# EAGLE design Kite-ARM-STM32F103 (EAGLE 6.5.0)
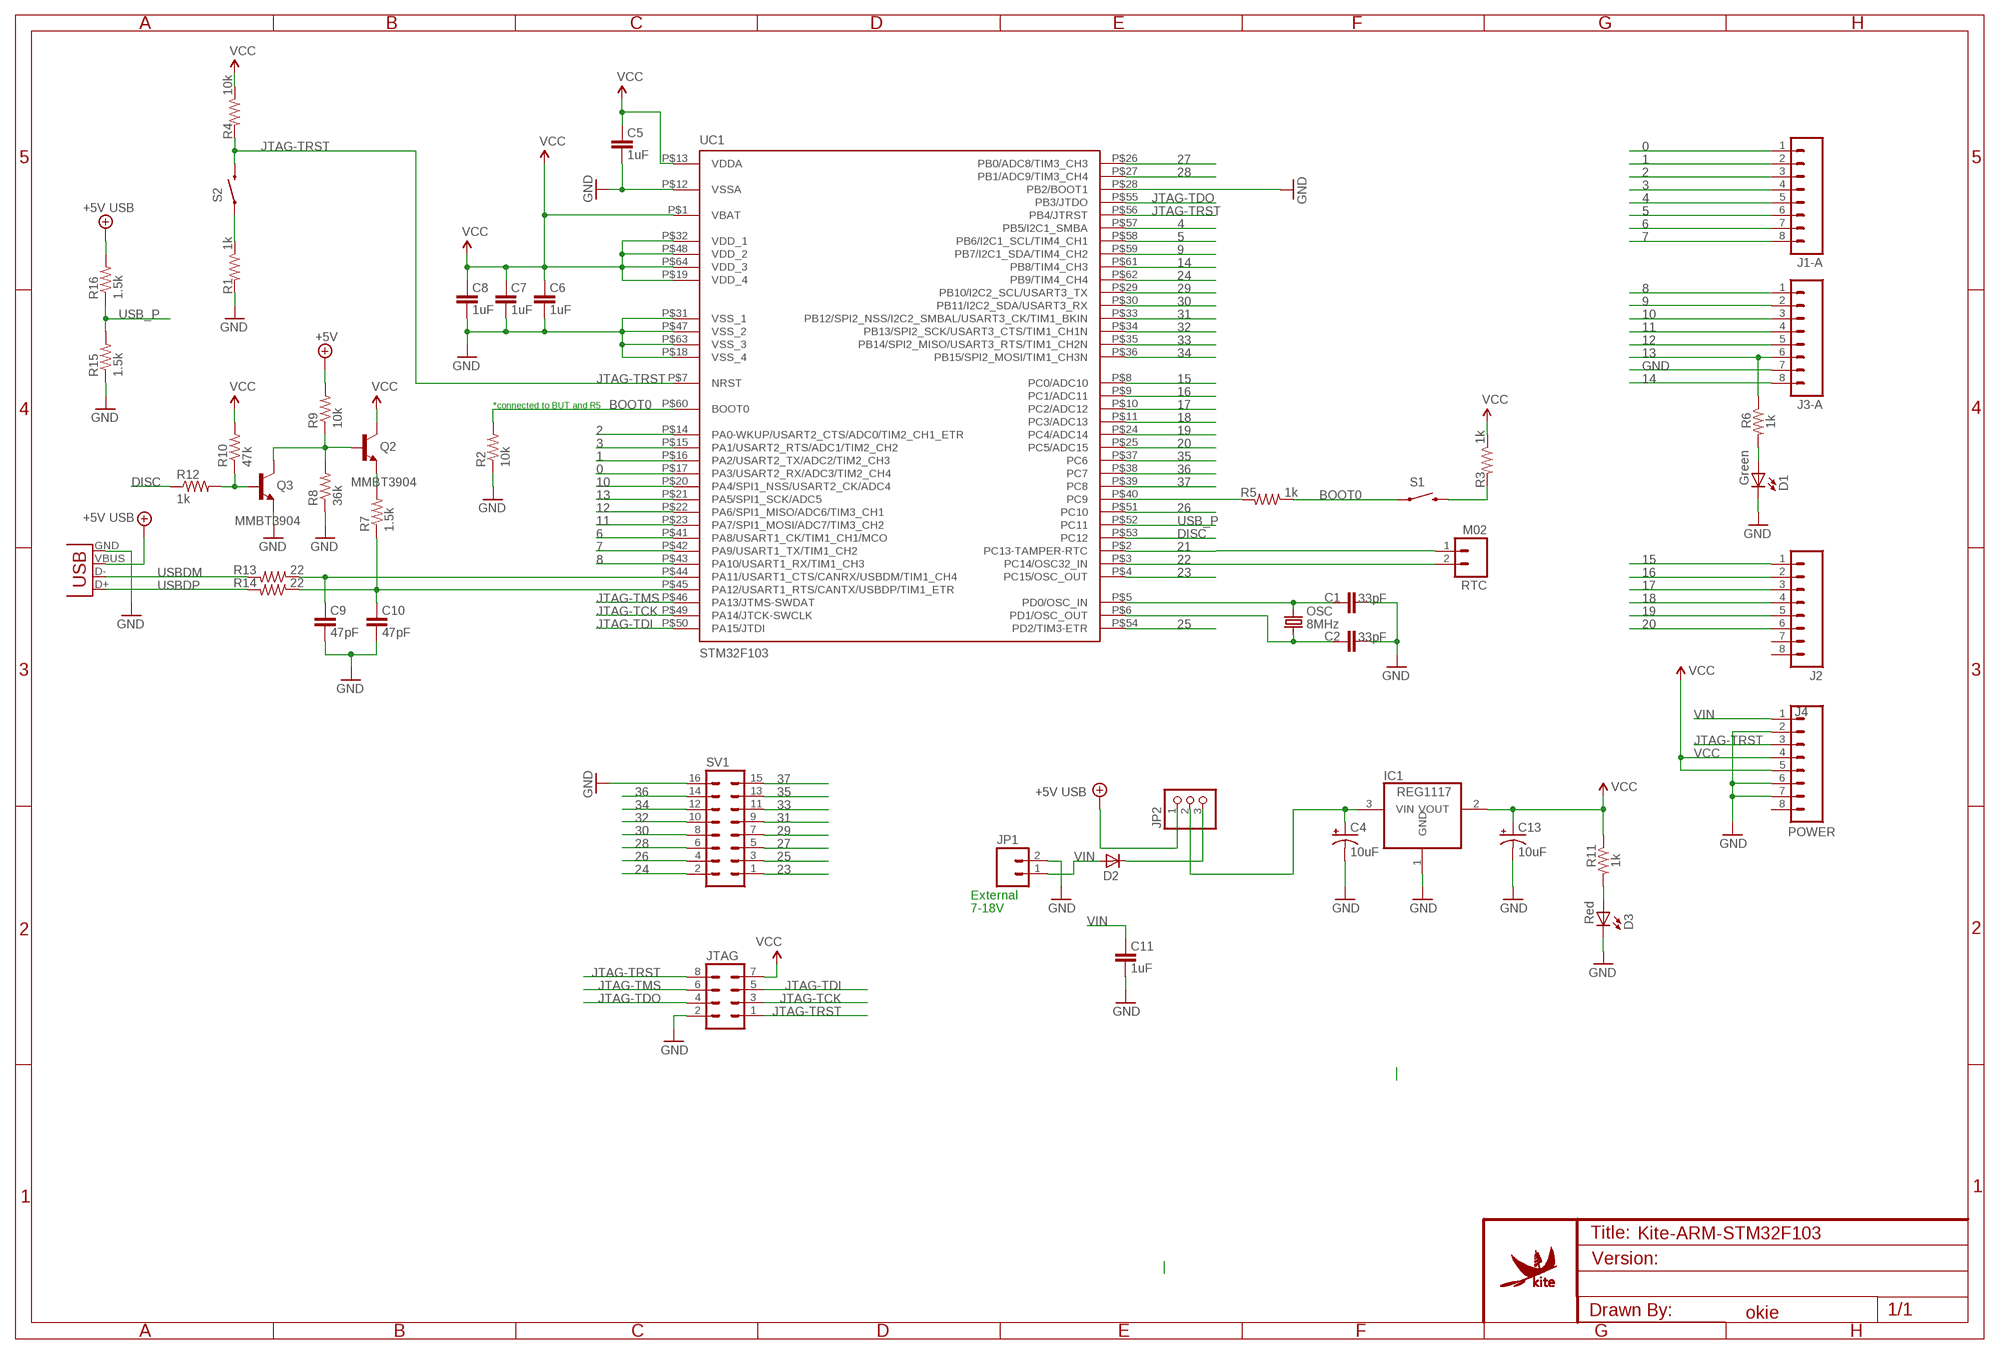
[diagram p0: schematic, sheet 1]

## Parts
C1  33pF  CAP0603  [0603]
C2  33pF  CAP0603  [0603]
C4  10uF  10UF-TANT  [EIA3216]
C5  1uF  CAP0603  [0603]
C6  1uF  CAP0603  [0603]
C7  1uF  CAP0603  [0603]
C8  1uF  CAP0603  [0603]
C9  47pF  CAP0603  [0603]
C10  47pF  CAP0603  [0603]
C11  1uF  CAP0603  [0603]
C13  10uF  10UF-TANT  [EIA3216]
D1  Green  LED0603  [LED-0603]
D2  DIODESMA  [SMA-DIODE]
D3  Red  LED0603  [LED-0603]
IC1  REG1117  [SOT223]
J1-A  M081X08  [1X08]
J2  M081X08  [1X08]
J3-A  M081X08  [1X08]
J4  POWER  M081X08  [1X08]
JP1  M02POLAR  [MOLEX-1X2]
JP2  PINHD-1X3  [1X03]
JTAG  MA04-2  [MA04-2]
OSC  8MHz  CRYSTAL5X3  [CRYSTAL-SMD-5X3]
Q2  MMBT3904  TRANSISTOR_NPNSOT23  [SOT23]
Q3  MMBT3904  TRANSISTOR_NPNSOT23  [SOT23]
R1  1k  RESISTOR0603  [0603]
R2  10k  RESISTOR0603  [0603]
R3  1k  RESISTOR0603  [0603]
R4  10k  RESISTOR0603  [0603]
R5  1k  RESISTOR0603  [0603]
R6  1k  RESISTOR0603  [0603]
R7  1.5k  RESISTOR0603  [0603]
R8  36k  RESISTOR0603  [0603]
R9  10k  RESISTOR0603  [0603]
R10  47k  RESISTOR0603  [0603]
R11  1k  RESISTOR0603  [0603]
R12  1k  RESISTOR0603  [0603]
R13  22  RESISTOR0603  [0603]
R14  22  RESISTOR0603  [0603]
R15  1.5k  RESISTOR0603  [0603]
R16  1.5k  RESISTOR0603  [0603]
RTC  M02  M02NG  [1X02]
S1  SWITCH-MOMENTARY-2-SMD-1101NE  [TACTILE-SWITCH-1101NE]
S2  SWITCH-MOMENTARY-2-SMD-1101NE  [TACTILE-SWITCH-1101NE]
SV1  MA08-2  [MA08-2]
U$3  KITE-LOGO-STM32-MEDIUM  [KITE-STM32-LOGO-MEDIUM]
UC1  STM32F103  [TQFP-10X10-64]
X1  USBSMD  [USB-MINIB]

## Nets
0: J1-A.1 UC1.P$17(PA3/USART2_RX/ADC3/TIM2_CH4)
1: J1-A.2 UC1.P$16(PA2/USART2_TX/ADC2/TIM2_CH3)
2: J1-A.3 UC1.P$14(PA0-WKUP/USART2_CTS/ADC0/TIM2_CH1_ETR)
3: J1-A.4 UC1.P$15(PA1/USART2_RTS/ADC1/TIM2_CH2)
4: J1-A.5 UC1.P$57(PB5/I2C1_SMBA)
5: J1-A.6 UC1.P$58(PB6/I2C1_SCL/TIM4_CH1)
6: J1-A.7 UC1.P$41(PA8/USART1_CK/TIM1_CH1/MCO)
7: J1-A.8 UC1.P$42(PA9/USART1_TX/TIM1_CH2)
8: J3-A.1 UC1.P$43(PA10/USART1_RX/TIM1_CH3)
9: J3-A.2 UC1.P$59(PB7/I2C1_SDA/TIM4_CH2)
10: J3-A.3 UC1.P$20(PA4/SPI1_NSS/USART2_CK/ADC4)
11: J3-A.4 UC1.P$23(PA7/SPI1_MOSI/ADC7/TIM3_CH2)
12: J3-A.5 UC1.P$22(PA6/SPI1_MISO/ADC6/TIM3_CH1)
13: J3-A.6 R6.1 UC1.P$21(PA5/SPI1_SCK/ADC5)
14: J3-A.8 UC1.P$61(PB8/TIM4_CH3)
15: J2.1 UC1.P$8(PC0/ADC10)
16: J2.2 UC1.P$9(PC1/ADC11)
17: J2.3 UC1.P$10(PC2/ADC12)
18: J2.4 UC1.P$11(PC3/ADC13)
19: J2.5 UC1.P$24(PC4/ADC14)
20: J2.6 UC1.P$25(PC5/ADC15)
21: RTC.1 UC1.P$2(PC13-TAMPER-RTC)
22: RTC.2 UC1.P$3(PC14/OSC32_IN)
23: SV1.1 UC1.P$4(PC15/OSC_OUT)
24: SV1.2 UC1.P$62(PB9/TIM4_CH4)
25: SV1.3 UC1.P$54(PD2/TIM3-ETR)
26: SV1.4 UC1.P$51(PC10)
27: SV1.5 UC1.P$26(PB0/ADC8/TIM3_CH3)
28: SV1.6 UC1.P$27(PB1/ADC9/TIM3_CH4)
29: SV1.7 UC1.P$29(PB10/I2C2_SCL/USART3_TX)
30: SV1.8 UC1.P$30(PB11/I2C2_SDA/USART3_RX)
31: SV1.9 UC1.P$33(PB12/SPI2_NSS/I2C2_SMBAL/USART3_CK/TIM1_BKIN)
32: SV1.10 UC1.P$34(PB13/SPI2_SCK/USART3_CTS/TIM1_CH1N)
33: SV1.11 UC1.P$35(PB14/SPI2_MISO/USART3_RTS/TIM1_CH2N)
34: SV1.12 UC1.P$36(PB15/SPI2_MOSI/TIM1_CH3N)
35: SV1.13 UC1.P$37(PC6)
36: SV1.14 UC1.P$38(PC7)
37: SV1.15 UC1.P$39(PC8)
+5V: JP2.1 R9.2 R16.2 X1.VBUS ; supply symbol labelled +5V USB
BOOT0: R2.2 R5.1 S1.P$1 UC1.P$60(BOOT0)
DISC: R12.1 UC1.P$53(PC12)
GND: C1.1 C2.1 C4.C(-) C5.1 C6.1 C7.1 C8.1 C9.1 C10.1 C11.1 C13.C(-) D1.C D3.C IC1.1(GND) J3-A.7 J4.2 J4.6 J4.7 JP1.2 JTAG.2 Q3.2(E) R1.2 R2.1 R8.1 R15.1 SV1.16 UC1.P$12(VSSA) UC1.P$18(VSS_4) UC1.P$28(PB2/BOOT1) UC1.P$31(VSS_1) UC1.P$47(VSS_2) UC1.P$63(VSS_3) X1.GND
JTAG-TCK: JTAG.3 UC1.P$49(PA14/JTCK-SWCLK)
JTAG-TDI: JTAG.5 UC1.P$50(PA15/JTDI)
JTAG-TDO: JTAG.4 UC1.P$55(PB3/JTDO)
JTAG-TMS: JTAG.6 UC1.P$46(PA13/JTMS-SWDAT)
JTAG-TRST: J4.3 JTAG.1 JTAG.8 R4.2 S2.P$2 UC1.P$7(NRST) UC1.P$56(PB4/JTRST)
N$1: D2.C JP2.3
N$2: C2.2 OSC.1 UC1.P$6(PD1/OSC_OUT)
N$3: C4.A(+) IC1.3(VIN) JP2.2
N$4: D3.A R11.2
N$6: C1.2 OSC.3 UC1.P$5(PD0/OSC_IN)
N$7: D1.A R6.2
N$8: Q2.2(E) R7.2
N$9: Q2.1(B) Q3.3(C) R8.2 R9.1
N$10: Q3.1(B) R10.1 R12.2
N$11: C9.2 R13.1 UC1.P$44(PA11/USART1_CTS/CANRX/USBDM/TIM1_CH4)
N$12: C10.2 R7.1 R14.1 UC1.P$45(PA12/USART1_RTS/CANTX/USBDP/TIM1_ETR)
N$25 [vcc]: R1.1 S2.P$1
N$26: R3.2 S1.P$2
N$27: R5.2 UC1.P$40(PC9)
USB_P: R15.2 R16.1 UC1.P$52(PC11)
USBDM: R13.2 X1.D-
USBDP: R14.2 X1.D+
VCC: C5.2 C6.2 C7.2 C8.2 C13.A(+) IC1.2(VOUT) J4.4 J4.5 JTAG.7 Q2.3(C) R3.1 R4.1 R10.2 R11.1 UC1.P$1(VBAT) UC1.P$13(VDDA) UC1.P$19(VDD_4) UC1.P$32(VDD_1) UC1.P$48(VDD_2) UC1.P$64(VDD_3)
VIN: C11.2 D2.A J4.1 JP1.1
Unconnected: J2.7 J2.8 J4.8

## Notes on the sheet
- *connected to BUT and R5
- External
- 7-18V
- okie

## Library data of the parts
C1 C2 C5-C11 = SparkFun:CAP: Capacitor Standard 0603 ceramic capacitor, and 0.1" leaded capacitor.
C4 C13 = SparkFun-Capacitors:10UF-TANT: 10uF Tantalum SMT CAP-00811- 16V 10% (EIA-3216); PROD_ID: CAP-00811
D1 D3 = SparkFun:LED: LEDs Standard schematic elements and footprints for 5mm, 3mm, 1206, and 0603 sized LEDs. 5mm - Spark Fun Electronics SKU : COM-00529 (and others)
D2 = SparkFun-DiscreteSemi:DIODE: Diode These are standard reverse protection diodes and small signal diodes. SMA package can handle up to about 1A. SOD-323 can handle about 200mA. What the SOD-323 package when ordering, there are some mfgs out there that are 5-pin packages.
IC1 = burr-brown:REG1117: 800mA and 1A Low Dropout (LDO) Positive Regulator 1.8V, 2.5V, 2.85V, 3.3V, 5V, and Adj; MPN: REG1117; OC_FARNELL: 1097566; OC_NEWARK: 14P6981
J1-A J2 J3-A J4 = SparkFun-Connectors:M08: Header 8 Standard 8-pin 0.1" header. Use with straight break away headers (SKU : PRT-00116), right angle break away headers (PRT-00553), swiss pins (PRT-00743), machine pins (PRT-00117), and female headers (PRT-00115).
JP1 = SparkFun2:M02: Header 2 Standard 2-pin 0.1" header. Use with straight break away headers (SKU : PRT-00116), right angle break away headers (PRT-00553), swiss pins (PRT-00743), machine pins (PRT-00117), and female headers (PRT-00115). Molex polarized connector foot print use with SKU : PRT-08233 with associated crimp pins and housings.
JP2 = adafruit:PINHD-1X3: PIN HEADER
JTAG = con-lstb:MA04-2: PIN HEADER; OC_FARNELL: unknown; OC_NEWARK: unknown
OSC = SparkFun2:CRYSTAL: Crystals Various standard crystals. Proven footprints. Spark Fun Electronics SKU : COM-00534
Q2 Q3 = SparkFun2:TRANSISTOR_NPN: Transistor NPN BJT configuration in SOT23 package. MMBT2222 is the common NPN we use. Double check BCE configuration again layout.
R1-R16 = SparkFun:RESISTOR: Resistor Basic schematic elements and footprints for 0603, 1206, and PTH 1/10th watt (small) resistors.
RTC = SparkFun3:M02NG
S1 S2 = SparkFun-Electromechanical:SWITCH-MOMENTARY-2: Various NO switches- pushbuttons, reed, etc
SV1 = con-lstb:MA08-2: PIN HEADER; OC_FARNELL: unknown; OC_NEWARK: unknown
U$3 = Kite:KITE-LOGO
UC1 = st-microelectronics:STM32F103
X1 = SparkFun2:USB: USB Connectors USB-B-PTH is fully proven SKU : PRT-00139 USB-miniB is fully proven SKU : PRT-00587 USB-A-PCB is untested. USB-A-H is throughly reviewed, but untested. Spark Fun Electronics SKU : PRT-00437 USB-B-SMT is throughly reviewed, but untested. Needs silkscreen touching up. USB-A-S has not been used/tested USB-MB-H has not been used/tested

## Net classes
0 default: width 0.203 mm
1 vcc: width 0.254 mm
2 gnd: width 0.305 mm, drill 0.508 mm, clearance 0.152 mm
3 usbvcc: width 0.508 mm, drill 0.508 mm, clearance 0.152 mm

## Board
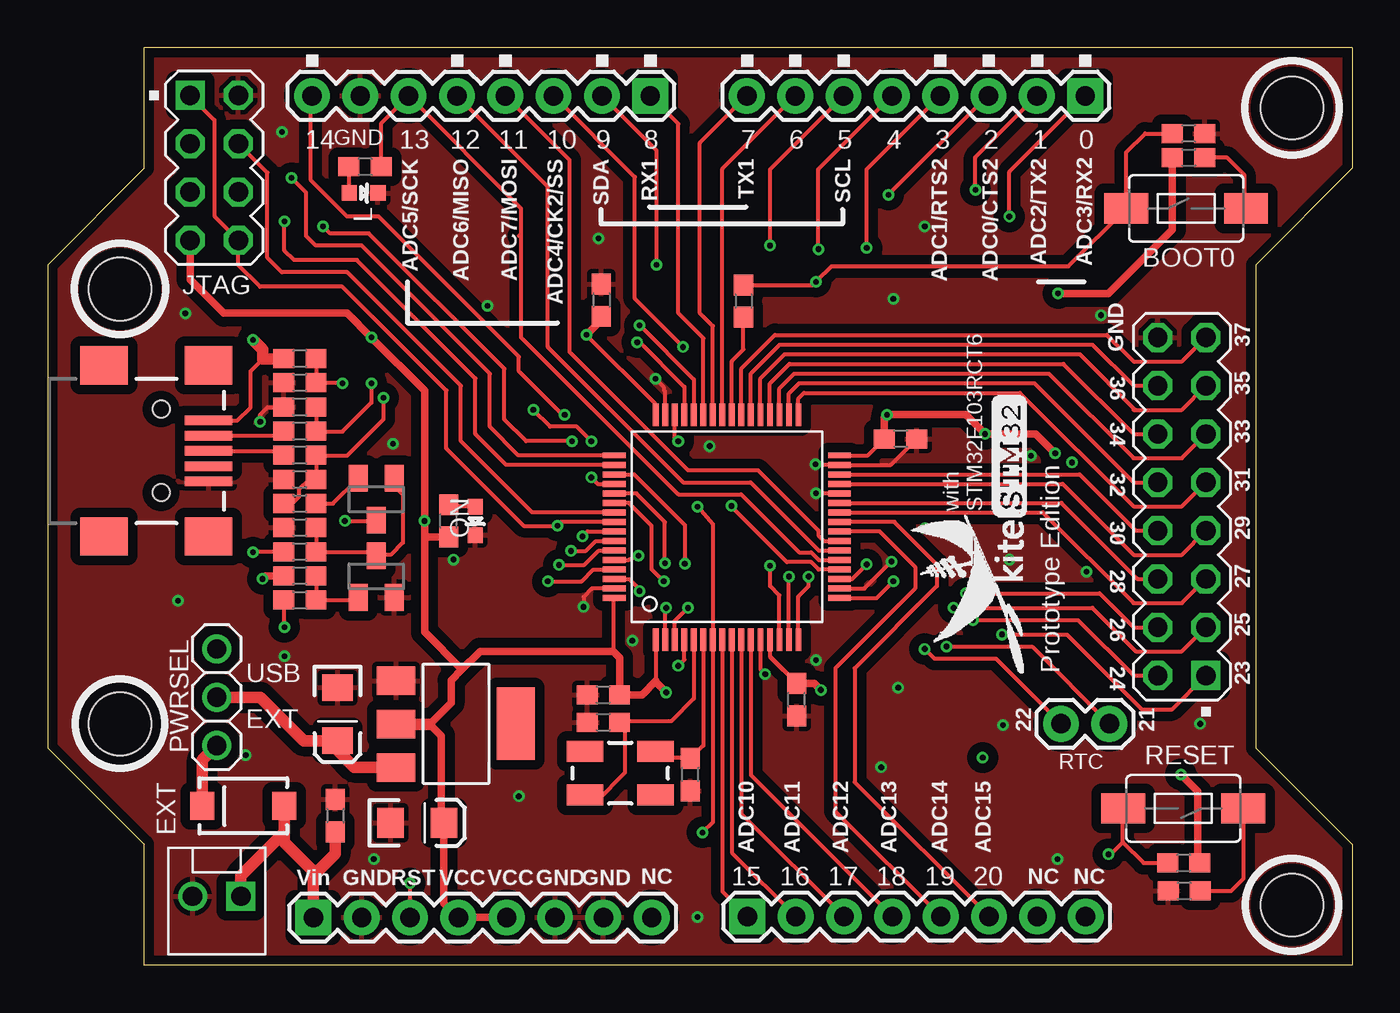
[diagram p1: board, top side]
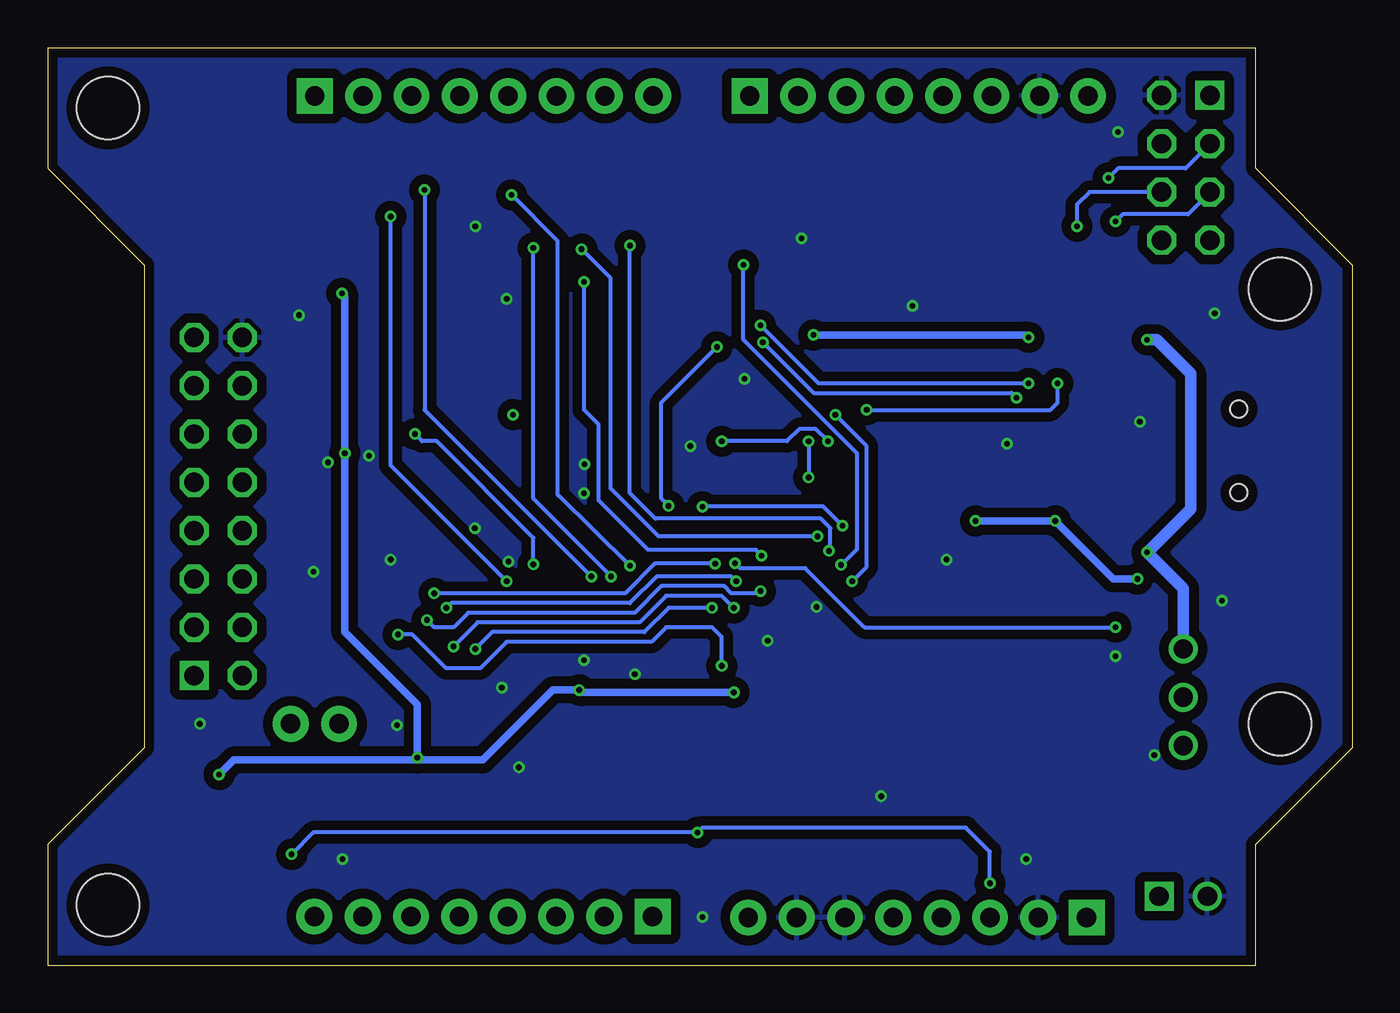
[diagram p2: board, bottom side, seen from below]

Size 68.58 x 48.26 mm. Coordinates in mm from the lower left corner, seen from the top.
Outline: 68.58,48.26 5.08,48.26 5.08,41.91 0,36.83 0,11.43 5.08,6.35 5.08,0 68.58,0 68.58,6.35 63.5,11.43 63.5,36.83 68.58,41.91 68.58,48.26
Copper layers (1*16): Top 0.035mm / dielectric 1.5mm / Bottom 0.035mm
Design rules "SparkFun *": minimum track width 6mil, minimum drill 15mil, track to track 6mil, track to pad 6mil, pad to pad 6mil, via to via 6mil, smd to smd 6mil, copper to edge 10mil, drill to drill 15mil, minimum pad ring 8mil, minimum via ring 6mil, stop-mask expansion 0mil, vias tented up to drill 20mil, thermal gap 10mil

### Footprints (pad centres in the part's own frame; a part is rotated, then mirrored left to right if it is on the bottom)
0603 = smd 1.1 x 1: 1 -0.85,0; 2 0.85,0
EIA3216 = smd 1.4 x 1.6: A 1.4,0; C -1.4,0
LED-0603 = smd 0.8 x 0.8: A 0,-0.75; C 0,0.75
SMA-DIODE = smd 1.27 x 1.47: A -2.15,0; C 2.15,0
SOT223 = smd 1.499 x 2.007: 1 -2.261,-3.15; 2 0.025,-3.15; 3 2.311,-3.15 | smd 3.81 x 2.007: 4 0,3.15
1X08 = drill 1.016 pad 1.88 square: 1 0,0 | drill 1.016 pad 1.88: 2 2.54,0; 3 5.08,0; 4 7.62,0; 5 10.16,0; 6 12.7,0; 7 15.24,0; 8 17.78,0
MOLEX-1X2 = drill 1.016 square: 1 0,0 | drill 1.016: 2 2.54,0
1X03 = drill 1.016: 1 -2.54,0; 2 0,0; 3 2.54,0
MA04-2 = drill 1.016 square: 1 -3.81,-1.27 | drill 1.016 octagon: 2 -3.81,1.27; 3 -1.27,-1.27; 4 -1.27,1.27; 5 1.27,-1.27; 6 1.27,1.27; 7 3.81,-1.27; 8 3.81,1.27
CRYSTAL-SMD-5X3 = smd 1.9 x 1.1: 1 -1.85,-1.15; 2 1.85,-1.15; 3 1.85,1.15; 4 -1.85,1.15
SOT23 = smd 1 x 1.4: 1 -0.95,-1.1; 2 0.95,-1.1; 3 0,1.1
1X02 = drill 1.016 pad 1.88: 1 0,0; 2 2.54,0
TACTILE-SWITCH-1101NE = smd 2.3 x 1.6: P$1 -3.15,0; P$2 3.15,0
MA08-2 = drill 1.016 square: 1 -8.89,-1.27 | drill 1.016 octagon: 2 -8.89,1.27; 3 -6.35,-1.27; 4 -6.35,1.27; 5 -3.81,-1.27; 6 -3.81,1.27; 7 -1.27,-1.27; 8 -1.27,1.27; 9 1.27,-1.27; 10 1.27,1.27; 11 3.81,-1.27; 12 3.81,1.27; 13 6.35,-1.27; 14 6.35,1.27; 15 8.89,-1.27; 16 8.89,1.27
STAND-OFF = hole 3.302: 0,0
TQFP-10X10-64 = smd 1.2 x 0.3: P$1 -5.936,3.75; P$2 -5.936,3.25; P$3 -5.936,2.75; P$4 -5.936,2.25; P$5 -5.936,1.75; P$6 -5.936,1.25; P$7 -5.936,0.75; P$8 -5.936,0.25; P$9 -5.936,-0.25; P$10 -5.936,-0.75; P$11 -5.936,-1.25; P$12 -5.936,-1.75; P$13 -5.936,-2.25; P$14 -5.936,-2.75; P$15 -5.936,-3.25; P$16 -5.936,-3.75; P$33 5.886,-3.75; P$34 5.886,-3.25; P$35 5.886,-2.75; P$36 5.886,-2.25; P$37 5.886,-1.75; P$38 5.886,-1.25; P$39 5.886,-0.75; P$40 5.886,-0.25; P$41 5.886,0.25; P$42 5.886,0.75; P$43 5.886,1.25; P$44 5.886,1.75; P$45 5.886,2.25; P$46 5.886,2.75; P$47 5.886,3.25; P$48 5.886,3.75 | smd 0.3 x 1.2: P$17 -3.75,-5.911; P$18 -3.25,-5.911; P$19 -2.75,-5.911; P$20 -2.25,-5.911; P$21 -1.75,-5.911; P$22 -1.25,-5.911; P$23 -0.75,-5.911; P$24 -0.25,-5.911; P$25 0.25,-5.911; P$26 0.75,-5.911; P$27 1.25,-5.911; P$28 1.75,-5.911; P$29 2.25,-5.911; P$30 2.75,-5.911; P$31 3.25,-5.911; P$32 3.75,-5.911; P$49 3.75,5.936; P$50 3.25,5.936; P$51 2.75,5.936; P$52 2.25,5.936; P$53 1.75,5.936; P$54 1.25,5.936; P$55 0.75,5.936; P$56 0.25,5.936; P$57 -0.25,5.936; P$58 -0.75,5.936; P$59 -1.25,5.936; P$60 -1.75,5.936; P$61 -2.25,5.936; P$62 -2.75,5.936; P$63 -3.25,5.936; P$64 -3.75,5.936
USB-MINIB = smd 2.5 x 0.5: D+ 2.5,0; D- 2.5,0.8; GND 2.5,-1.6; ID 2.5,-0.8; VBUS 2.5,1.6 | smd 2.5 x 2: GND@1 -3,-4.5; GND@2 -3,4.5; GND@3 2.5,4.5; GND@4 2.5,-4.5 | hole 0.9: 0,2.2; 0,-2.2

### Placement (x,y rotation side)
C1  29.21,12.78 0 top
C2  33.78,10.03 90 top
C4  15.24,13.21 270 top
C5  39.37,13.97 90 top
C6  44.83,27.69 180 top
C7  29.11,34.98 270 top
C8  29.21,14.22 0 top
C9  13.26,29.36 0 top
C10  13.26,25.55 0 top
C11  15.11,7.87 270 top
C13  19.43,7.49 0 top
D1  16.61,40.61 270 top
D2  10.29,8.38 180 top
D3  22.48,23.37 180 top
IC1  21.46,12.7 270 top
J1-A  54.53,45.72 180 top
J2  36.78,2.57 0 top
J3-A  31.67,45.72 180 top
J4  13.97,2.51 0 top
JP1  10.16,3.63 180 top
JP2  8.89,14.1 270 top
JTAG  8.76,41.94 270 top
OSC  30.1,10.11 180 top
Q2  17.27,24.51 180 top
Q3  17.27,20.45 0 top
R1  59.74,3.91 180 top
R2  59.97,43.74 180 top
R3  59.97,42.47 0 top
R4  59.72,5.38 180 top
R5  36.58,34.93 270 top
R6  16.69,41.99 180 top
R7  13.26,24.28 0 top
R8  13.26,23.01 0 top
R9  13.26,21.74 180 top
R10  13.26,20.47 180 top
R11  21.08,23.37 90 top
R12  13.26,19.2 0 top
R13  13.26,28.09 180 top
R14  13.26,26.82 180 top
R15  13.26,30.63 0 top
R16  13.26,31.9 180 top
RTC  55.8,12.7 180 top
S1  59.84,39.8 0 top
S2  59.69,8.26 180 top
SV1  59.61,24.13 90 top
U$1  STAND-OFF  [STAND-OFF]  3.81,12.7 0 top
U$2  STAND-OFF  [STAND-OFF]  65.41,45.09 0 top
U$3  51.44,15.37 90 top
U$4  STAND-OFF  [STAND-OFF]  3.81,35.56 0 top
U$10  STAND-OFF  [STAND-OFF]  65.41,3.17 0 top
UC1  35.71,23.06 90 top
X1  5.97,27.05 0 top

### Tracks (layer width: path | path; a pad name or v marks a point on that pad's centre or on a via)
0  (via drill 0.3)
  Top 0.203: UC1.P$17 43.57,19.31 v44.45,20.19 | v50.55,39.37 50.55,41.73 J1-A.1
  Bottom 0.203: v50.55,39.37 50.55,26.29 v44.45,20.19
1  (via drill 0.3)
  Top 0.203: UC1.P$16 39.46,19.4 40.01,19.94 v40.01,20.45 | v48.77,40.77 48.77,42.49 J1-A.2
  Bottom 0.203: v40.01,20.45 48.77,29.21 v48.77,40.77
2  (via drill 0.3)
  Top 0.203: UC1.P$14 38.46,19.45 37.97,19.94 v37.97,21.02 | J1-A.3 49.4,45.72 v44.2,40.51
  Bottom 0.203: v37.97,21.02 41.72,24.7 | 41.72,24.7 41.78,24.76 | 41.72,24.7 41.78,24.77 41.78,38.1 v44.2,40.51
3  (via drill 0.3)
  Top 0.203: UC1.P$15 v38.96,20.45 | v43.05,37.72 43.05,41.86 J1-A.4
  Bottom 0.203: v38.96,20.45 43.05,24.54 v43.05,37.72
4  (via drill 0.3)
  Top 0.203: UC1.P$57 28.38,22.81 v28.12,22.55 | v40.51,37.66 40.51,41.86 J1-A.5
  Bottom 0.203: v40.51,37.66 38.99,36.13 38.99,25.08 36.46,22.55 v28.12,22.55
5  (via drill 0.3)
  Top 0.203: UC1.P$58 28.82,22.31 28.3,21.79 v27.51,21.79 | v37.97,37.85 37.97,41.86 J1-A.6
  Bottom 0.203: v27.51,21.79 27.51,21.82 27.43,21.89 27.43,22.99 27.94,23.49 36.64,23.49 37.97,24.83 v37.97,37.85
6
  Top 0.203: J1-A.7 35.46,41.89 UC1.P$41
7
  Top 0.203: UC1.P$42 34.96,33.62 34.29,34.29 34.29,43.26 J1-A.8
8
  Top 0.203: UC1.P$43 34.46,32.98 33.15,34.29 33.15,44.25 J3-A.1
9  (via drill 0.3)
  Top 0.203: UC1.P$59 28.98,21.81 28.22,21.06 v26.87,21.06 | v32,36.83 32,42.85 J3-A.2
  Bottom 0.203: v26.87,21.06 26.04,21.89 26.04,26.92 32,32.89 v32,36.83
10  (via drill 0.3)
  Top 0.203: UC1.P$20 40.53,20.81 40.13,21.21 38.86,21.21 35.94,24.13 v35.94,24.15 | J3-A.3 30.86,41.45 30.86,35.05 v33.4,32.51
  Bottom 0.203: v33.4,32.51 36.32,29.59 36.32,24.54 v35.94,24.15
11
  Top 0.203: UC1.P$23 40.81,22.31 40.51,22.61 40.51,22.86 37.34,26.04 33.66,26.04 27.43,32.26 27.43,42.34 J3-A.4
12
  Top 0.203: UC1.P$22 40.54,21.81 36.96,25.4 33.4,25.4 26.29,32.51 26.29,40.95 J3-A.5
13
  Top 0.203: UC1.P$21 40.54,21.31 40.13,21.72 39.5,21.72 36.45,24.76 33.15,24.76 24.89,33.02 24.89,38.48 | 24.89,38.48 24.89,39.8 J3-A.6 17.54,44.28 R6.1 | 24.77,38.35 24.89,38.48
14  (via drill 0.3)
  Top 0.203: UC1.P$61 28.69,20.81 28.07,20.19 v26.29,20.19 | J3-A.8 13.84,45.67 13.84,41.28 15.75,39.37 17.4,39.37 24.77,32 24.77,31.24 27.05,28.96 v27.18,28.96
  Bottom 0.203: v26.29,20.19 25.53,20.95 25.53,27.3 v27.18,28.96
15
  Top 0.203: UC1.P$8 35.46,3.88 J2.1
16
  Top 0.203: UC1.P$9 35.96,5.92 J2.2
17
  Top 0.203: UC1.P$10 36.46,7.96 J2.3
18
  Top 0.203: UC1.P$11 36.96,10 J2.4
19
  Top 0.203: UC1.P$24 43.73,22.81 45.59,20.95 45.59,19.81 41.4,15.62 41.4,8.1 J2.5
20
  Top 0.203: UC1.P$25 44.51,23.31 46.74,21.08 46.74,19.94 42.42,15.62 42.42,9.63 J2.6
21  (via drill 0.3)
  Top 0.203: UC1.P$2 32.46,18.75 v32.51,18.8 | v47.24,16.76 51.74,16.76 RTC.1
  Bottom 0.203: 32.64,18.8 v32.51,18.8 33.15,19.43 36.07,19.43 37.47,18.03 45.97,18.03 v47.24,16.76
22  (via drill 0.3)
  Top 0.203: UC1.P$3 32.96,18.1 v33.66,18.8 | v46.1,16.64 46.61,16.13 49.84,16.13 RTC.2
  Bottom 0.203: v33.66,18.8 35.94,18.8 37.21,17.53 45.21,17.53 v46.1,16.64
23  (via drill 0.3)
  Top 0.203: UC1.P$4 33.46,16.06 v33.15,15.75 | SV1.1 59.11,13.46 57.51,13.46 53.57,17.4 v50.16,17.4
  Bottom 0.203: v33.15,15.75 33.15,17.27 33.66,17.78 36.07,17.78 36.83,17.02 44.45,17.02 45.85,15.62 47.62,15.62 49.4,17.4 v50.16,17.4
24  (via drill 0.3)
  Top 0.203: UC1.P$62 30.56,20.31 31.11,19.76 v31.11,19.68 | v48.64,18.16 54.15,18.16 57.07,15.24 SV1.2
  Bottom 0.203: 31.11,19.56 v31.11,19.68 31.24,19.56 32.64,19.56 33.02,19.94 36.32,19.94 37.72,18.54 46.48,18.54 47.24,17.78 48.26,17.78 v48.64,18.16
25  (via drill 0.3)
  Top 0.203: UC1.P$54 30.55,24.31 31.75,23.11 31.75,20.83 v32.38,20.19 | SV1.3 59.61,16.51 57.2,16.51 54.91,18.8 v47.62,18.8
  Bottom 0.203: v32.38,20.19 32.64,20.45 36.58,20.45 37.97,19.05 47.37,19.05 v47.62,18.8
26  (via drill 0.3)
  Top 0.203: UC1.P$51 30.83,25.81 33.49,23.15 v33.49,21.12 | v48.26,19.56 55.3,19.56 57.07,17.78 SV1.4
  Bottom 0.203: v33.49,21.12 36.66,21.12 38.23,19.56 v48.26,19.56
27
  Top 0.203: SV1.5 59.61,19.05 57.07,19.05 52.31,23.81 UC1.P$26
28
  Top 0.203: UC1.P$27 53.28,24.31 57.28,20.32 SV1.6
29
  Top 0.203: SV1.7 59.61,21.59 57.07,21.59 53.35,25.31 UC1.P$29
30
  Top 0.203: SV1.8 57.2,22.86 54.25,25.81 UC1.P$30
31
  Top 0.203: UC1.P$33 39.46,29.81 39.75,30.1 51.1,30.1 57.07,24.13 59.61,24.13 SV1.9
32
  Top 0.203: UC1.P$34 38.96,30.07 39.5,30.61 51.87,30.61 57.07,25.4 SV1.10
33
  Top 0.203: UC1.P$35 38.46,30.33 39.24,31.11 52.63,31.11 57.07,26.67 59.61,26.67 SV1.11
34
  Top 0.203: UC1.P$36 37.96,30.6 38.99,31.62 53.39,31.62 57.07,27.94 SV1.12
35
  Top 0.203: UC1.P$37 37.46,30.86 38.73,32.13 54.25,32.13 57.17,29.21 | 57.07,29.21 57.17,29.21 | 57.17,29.21 59.61,29.21 SV1.13
36
  Top 0.203: UC1.P$38 36.96,31.12 38.48,32.64 54.91,32.64 57.07,30.48 SV1.14
37
  Top 0.203: UC1.P$39 36.46,31.38 38.23,33.15 55.68,33.15 57.07,31.75 59.61,31.75 SV1.15
+5V  (via drill 0.3)
  Top 0.203: X1.VBUS 9.98,28.65 10.67,29.34 10.67,31.24 11.3,31.88 | 12.38,31.88 R16.2 | R9.2 10.82,21.74 v10.79,21.72
  Top 0.61: 12.38,31.88 11.3,31.88 11.3,32.39 v10.79,32.89
  Bottom 0.61: v10.79,32.89 10.29,32.89 8.51,31.11 8.51,24 v10.79,21.72 8.89,19.81 JP2.1
BOOT0  (via drill 0.3, 0.3 pad 0.38)
  Top 0.203: UC1.P$60 30.52,21.31 v31.05,21.54 | R2.2 57.68,43.74 56.69,42.75 S1.P$1 53.66,36.77 41.21,36.77 v40.39,35.94 40.22,35.78 R5.1
  Bottom 0.203: v31.05,21.54 31.36,21.84 37.02,21.84 39.62,24.45 39.62,28.45 40.39,29.21 v40.39,35.94
DISC  (via drill 0.3)
  Top 0.203: UC1.P$53 30.94,24.81 32.45,23.3 v32.45,21.14 32.38,21.08 | v12.45,17.78 12.45,19.16 R12.1
  Bottom 0.203: v32.45,21.14 32.18,20.88 28.75,20.88 25.65,17.78 v12.45,17.78
GND  (via drill 0.3)
  Top 0.203: UC1.P$28 v40.39,24.81 v40.39,24.82 | v40.36,26.34 40.39,26.31 UC1.P$31 44.31,26.31 C6.1 | UC1.P$47 32.46,30.17 32.41,30.23 32.41,30.38 v31.95,30.84 | UC1.P$18 42.93,19.81 v44.35,21.23 | UC1.P$12 37.46,15.57 v37.72,15.32 | UC1.P$63 28.6,19.81 28.17,19.38 v28.17,18.85 | v11.18,28.57 11.18,28.96 11.56,29.34 12.38,29.34 C9.1
  other vias: 55.37,34.19 21.34,21.34 50.55,21.34 23.11,34.67 46.1,38.86 44.7,14.61 43.81,10.41 53.09,5.59 34.16,2.54 24.77,8.89 10.41,11.05 12.45,16.26 6.86,19.18 28.96,38.23 44.45,35.05 51.69,26.8 7.24,34.29 12.32,43.82 17.14,5.59 50.22,12.62 54.61,20.7 34.8,27.3 30.73,17.07 40.39,16.05 18.16,27.43 53.85,26.44 60.58,12.7 46.13,22.99
  pour Top (isolate 0.508): -0.25,48.13 -0.25,-0.13 68.71,-0.13 68.71,48.13
  pour Bottom (isolate 0.508): -0.13,48.13 -0.13,-0.25 68.58,-0.25 68.58,48.13
JTAG-TCK  (via drill 0.3)
  Top 0.203: v12.83,41.4 13.59,40.64 13.59,38.35 14.1,37.85 16.51,37.85 23.24,31.11 23.24,28.32 24.75,26.81 UC1.P$49
  Bottom 0.203: JTAG.3 7.49,43.18 8.76,41.91 12.32,41.91 v12.83,41.4
JTAG-TDI  (via drill 0.3)
  Top 0.203: v12.45,39.12 12.45,37.59 12.95,37.08 16.26,37.08 22.48,30.86 22.48,27.94 24.11,26.31 UC1.P$50
  Bottom 0.203: JTAG.5 7.49,40.64 8.64,39.5 12.06,39.5 v12.45,39.12
JTAG-TDO
  Top 0.203: UC1.P$55 25.46,23.81 21.72,27.56 21.72,30.48 15.75,36.45 12.32,36.45 11.56,37.21 11.56,41.68 JTAG.4
JTAG-TMS  (via drill 0.3)
  Top 0.203: 33.02,27.56 v33.15,27.56 32.96,27.74 UC1.P$46 | v27.56,27.56 25.15,27.56 24,28.7 24,31.37 16.89,38.48 14.86,38.48 v14.48,38.86
  Bottom 0.203: v27.56,27.56 28.19,28.19 29.08,28.19 29.72,27.56 v33.15,27.56 | JTAG.6 13.82,40.66 14.48,40.01 v14.48,38.86
JTAG-TRST  (via drill 0.3)
  Top 0.203: v34.16,24.12 34.96,23.2 UC1.P$7 34.96,7.53 v34.42,6.98 | v55.75,5.84 55.88,5.84 56.52,6.48 | 56.52,6.48 56.52,8.23 S2.P$2 | 56.52,6.48 57.61,5.38 R4.2 | J4.3 v19.05,4.32 | UC1.P$56 27,23.31 v26.8,23.11 25.02,23.11 20.95,27.18 20.95,30.23 15.49,35.69 11.18,35.69 10.03,36.83 JTAG.8 8.76,39.4 8.76,44.45 7.49,45.72 JTAG.1
  Bottom 0.203: v34.16,24.12 34.16,24.13 27.81,24.13 v26.8,23.11 | v55.75,5.84 54.61,6.98 v34.42,6.98 34.16,7.24 20.32,7.24 19.05,5.97 v19.05,4.32
N$1
  Top 0.61: D2.C 8.14,10.8 JP2.3
N$2
  Top 0.203: 31.95,10.94 OSC.1 32.47,11.01 32.56,11.09 | 31.95,10.94 31.88,10.87 | C2.2 33.91,10.92 32.64,10.92 31.95,10.94 | 33.83,10.93 C2.2 | UC1.P$6 34.46,11.56 C2.2
N$3
  Top 0.406: C4.A
  Top 0.61: C4.A 15.24,11.3 16.13,10.41 18.29,10.41 IC1.3 | C4.A 13.46,11.81 11.18,14.1 JP2.2
N$4
  Top 0.203: D3.A 21.18,24.12 R11.2
N$6
  Top 0.203: 29.97,12.57 C1.2 | OSC.3 28.84,8.71 28.88,8.66 30.35,10.13 30.35,12.48 C1.2 | UC1.P$5 33.96,14.02 32.77,12.83 30.11,12.83 C1.2
N$7
  Top 0.203: R6.2 15.84,40.64 D1.A
N$8
  Top 0.203: R7.2 14.99,24.28 Q2.2
N$9
  Top 0.203: R8.2 R9.1 17.08,21.74 Q3.3 17.32,21.59 18.03,21.59 18.67,22.22 18.67,24.76 18.22,25.21 Q2.1
N$10
  Top 0.203: R10.1 R12.2 16.18,19.2 Q3.1
N$11  (via drill 0.3)
  Top 0.203: UC1.P$44 33.96,30.81 v31.11,33.66 | C9.2 R13.1 14.13,28.07 15.49,28.07 17.02,29.59 v17.02,30.61
  Bottom 0.203: v17.02,30.61 28.07,30.61 v31.11,33.66
N$12  (via drill 0.3)
  Top 0.203: UC1.P$45 33.46,30.42 31.11,32.77 v30.99,32.77 | 12.84,24.28 R7.1 12.51,24.38 12.95,24.38 13.21,24.64 13.21,25.02 13.74,25.55 C10.2 R14.1 14.13,26.8 15.75,26.8 17.65,28.7 v17.65,29.84
  Bottom 0.203: v17.65,29.84 17.91,30.1 28.32,30.1 v30.99,32.77
N$25
  Top 0.203: R1.1 62.2,3.91 62.87,4.57 62.87,8.23 S2.P$1
N$26
  Top 0.203: S1.P$2 62.89,39.9 62.89,41.58 62,42.47 R3.2
N$27
  Top 0.203: UC1.P$40 35.96,31.77 36.58,32.39 R5.2
USB_P  (via drill 0.3)
  Top 0.203: UC1.P$52 28.92,25.31 v28.57,25.65 | v28.57,27.56 27.81,28.32 26.42,28.32 v25.53,29.21 | R16.1 R15.2 14.13,30.61 v15.49,30.61
  Bottom 0.203: v28.57,27.56 v28.57,25.65 | v15.49,30.61 15.49,29.59 15.88,29.21 v25.53,29.21
USBDM
  Top 0.203: X1.D- 12.17,27.85 R13.2
USBDP
  Top 0.203: X1.D+ 12.18,27.05 R14.2
VCC  (via drill 0.3)
  Top 0.203: 31.96,29.49 UC1.P$48 31.96,29.51 v28.32,33.15 | 29.72,19.23 29.72,16.51 | UC1.P$32 43.11,26.81 C6.2 | 31.96,14.94 UC1.P$1 31.96,14.9 | v15.62,23.37 17.23,23.37 Q2.3 | 60.45,5.5 R4.1 | C7.2 29.11,33.93 | C5.2 37.96,16.23 UC1.P$13 37.96,16.27 39.62,14.61 | UC1.P$19 42.28,20.31 v43.05,21.08
  Top 0.254: UC1.P$64 29.75,19.31 29.69,19.25 29.72,19.23
  Top 0.406: 31.96,14.94 31.24,14.22 C8.2 30.06,16.17 29.72,16.51 22.73,16.51 21.78,15.56 | 20.7,7.62 20.7,12.07 20.09,12.68 21.21,13.79 21.21,14.99 21.78,15.56 | C13.A 20.83,3.27 J4.4 J4.5 | R10.2 11.46,20.47 v11.3,20.32 | 19.81,22.61 19.81,17.53 21.78,15.56 | 19.81,22.61 v19.81,23.37 19.81,30.23 v17.02,33.02 15.75,34.29 9.27,34.29 7.49,36.07 JTAG.7 | R3.1 59.12,38.7 55.75,35.33 v53.11,35.33 | C5.2 40.3,14.82 v40.64,14.48 | v59.56,10.03 60.45,9.14 60.45,5.5 | 29.11,33.93 v28.32,33.15 | C6.2 43.98,28.82 v44.12,28.96 48.26,28.96 v49.28,27.94 51.94,27.94 v52.96,26.92 | 31.96,14.9 v32.51,14.35 | R11.1 19.9,22.52 19.81,22.61
  Top 0.61: IC1.2 20.09,12.68 | 20.7,7.62 C13.A
  Bottom 0.203: 40.51,14.35 v40.64,14.48 | v43.05,21.08 43.05,22.48 48.13,27.56 48.9,27.56 v49.28,27.94
  Bottom 0.406: v11.3,20.32 12.57,20.32 v15.62,23.37 v19.81,23.37 | v40.64,14.48 42.04,14.48 45.72,10.79 49.15,10.79 | 49.15,10.79 58.8,10.79 v59.56,10.03 | v32.51,14.35 40.51,14.35 | 49.15,10.79 v49.15,10.92 49.15,13.72 52.96,17.53 v52.96,26.92 52.96,35.18 v53.11,35.33 | v28.32,33.15 17.14,33.15 v17.02,33.02
VIN
  Top 0.61: J4.1 13.97,4.71 | C11.2 15.11,5.85 13.97,4.71 | JP1.1 10.16,4.7 12.45,6.98 | 13.97,4.71 13.97,4.95 12.45,6.48 12.45,6.98 | 12.45,6.98 12.45,8.37 D2.A

### Text on the board
tPlace: 14 | GND | 13 | 12 | 11 | 10 | 9 | 8 | 7 | 6 | 5 | 4 | 3 | 2 | 1 | 0 | ADC5/SCK | ADC6/MISO | ADC7/MOSI | ADC4/CK2/SS | SDA | RX1 | TX1 | SCL | ADC1/RTS2 | ADC0/CTS2 | ADC2/TX2 | ADC3/RX2 | L | JTAG | BOOT0 | 37 | GND | 36 | 35 | 34 | 33 | 32 | 31 | with / STM32F103RCT6 | 30 | 29 | ON | 28 | 27 | 26 | 25 | PWRSEL | Prototype Edition | 24 | 23 | USB | 22 | 21 | EXT | RTC | RESET | EXT | ADC10 | ADC11 | ADC12 | ADC13 | ADC14 | ADC15 | NC | NC | NC | Vin | GND | RST | VCC | VCC | GND | GND | 15 | 16 | 17 | 18 | 19 | 20
Reference: USART2-CK | I2C1 | SPI1 | USART1 | USART2 | original: LeafLabs Maple r5 | GND | 37 | 36 | 35 | 34 SPI2-MOSI | 33 SPI2-MISO/USART3-RTS | 32 SPI2-SCK/USART3-CTS | 31 SPI2-NSS/USART3-CK | 30 USART3-RX/I2C2-SDA | 29 USART3-TX/I2C2-SCL | 28 PWM/ADC9 | 27 PWM/ADC8 | 26 | 25 | 24 PWM | 23